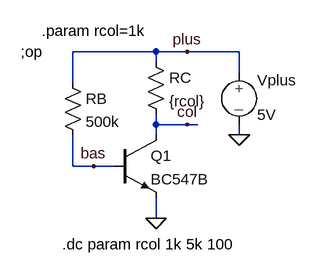
[diagram p0: schematic q1_1.asc]
q1_1.asc, the LTspice schematic file:
Version 4
SHEET 1 880 680
WIRE 224 -32 96 -32
WIRE 272 -32 224 -32
WIRE 352 -32 272 -32
WIRE 224 -16 224 -32
WIRE 352 0 352 -32
WIRE 96 16 96 -32
WIRE 224 80 224 64
WIRE 272 80 224 80
WIRE 288 80 272 80
WIRE 224 96 224 80
WIRE 352 96 352 80
WIRE 96 144 96 96
WIRE 128 144 96 144
WIRE 160 144 128 144
WIRE 224 224 224 192
FLAG 224 224 0
FLAG 352 96 0
FLAG 272 80 col
FLAG 128 144 bas
FLAG 272 -32 plus
SYMBOL EIT_Semiconductors\\npn 160 96 R0
SYMATTR InstName Q1
SYMATTR Value BC547B
SYMBOL res 80 0 R0
SYMATTR InstName RB
SYMATTR Value 500k
SYMBOL res 208 -32 R0
SYMATTR InstName RC
SYMATTR Value {rcol}
SYMBOL source-V 352 -16 R0
SYMATTR InstName Vplus
SYMATTR Value 5V
TEXT 16 -32 Left 2 !;op
TEXT 48 -64 Left 2 !.param rcol=1k
TEXT 80 264 Left 2 !.dc param rcol 1k 5k 100

The netlist it stands for:
* q1_1.asc
Q1 col bas 0 0 BC547B
RB plus bas 500k
RC plus col {rcol}
Vplus plus 0 5V
.model NPN NPN
.model PNP PNP
.lib standard.bjt
;op
.param rcol=1k
.dc param rcol 1k 5k 100
.backanno
.end